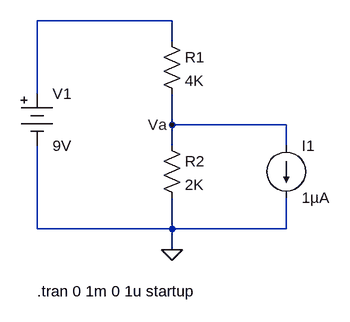
[diagram p0: schematic Design Challenge 2.asc]
Design Challenge 2.asc, the LTspice schematic file:
Version 4
SHEET 1 880 680
WIRE 336 160 128 160
WIRE 336 192 336 160
WIRE 128 272 128 160
WIRE 336 320 336 272
WIRE 512 320 336 320
WIRE 336 352 336 320
WIRE 512 352 512 320
WIRE 128 480 128 352
WIRE 336 480 336 432
WIRE 336 480 128 480
WIRE 512 480 512 432
WIRE 512 480 336 480
WIRE 336 512 336 480
FLAG 336 512 0
FLAG 336 320 Va
SYMBOL Misc/battery 128 256 R0
SYMATTR InstName V1
SYMATTR Value 9V
SYMBOL res 320 176 R0
SYMATTR InstName R1
SYMATTR Value 4K
SYMBOL res 320 336 R0
SYMATTR InstName R2
SYMATTR Value 2K
SYMBOL current 512 352 R0
SYMATTR InstName I1
SYMATTR Value 1µA
TEXT 128 576 Left 2 !.tran 0 1m 0 1u startup

The netlist it stands for:
* Design Challenge 2.asc
V1 N001 0 9V
R1 N001 Va 4K
R2 Va 0 2K
I1 Va 0 1µA
.tran 0 1m 0 1u startup
.backanno
.end